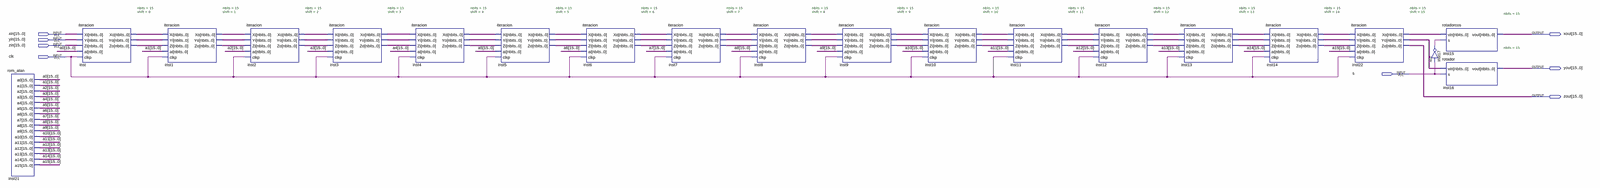
[diagram p0: schematic sheet, whole]
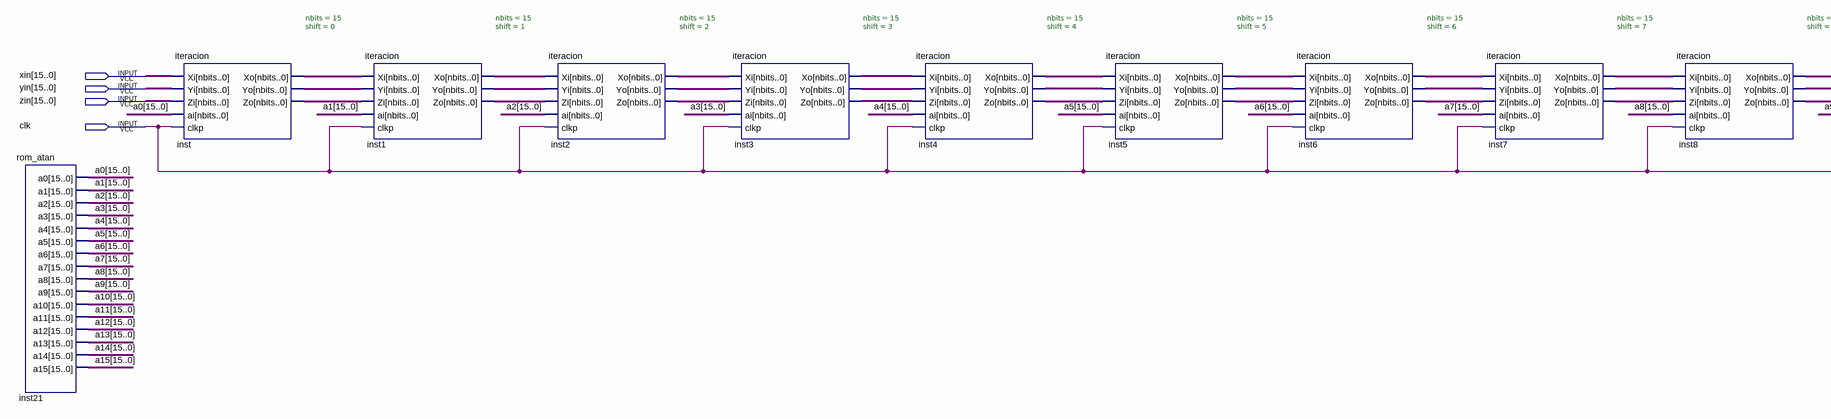
[diagram p1: schematic sheet, left part]
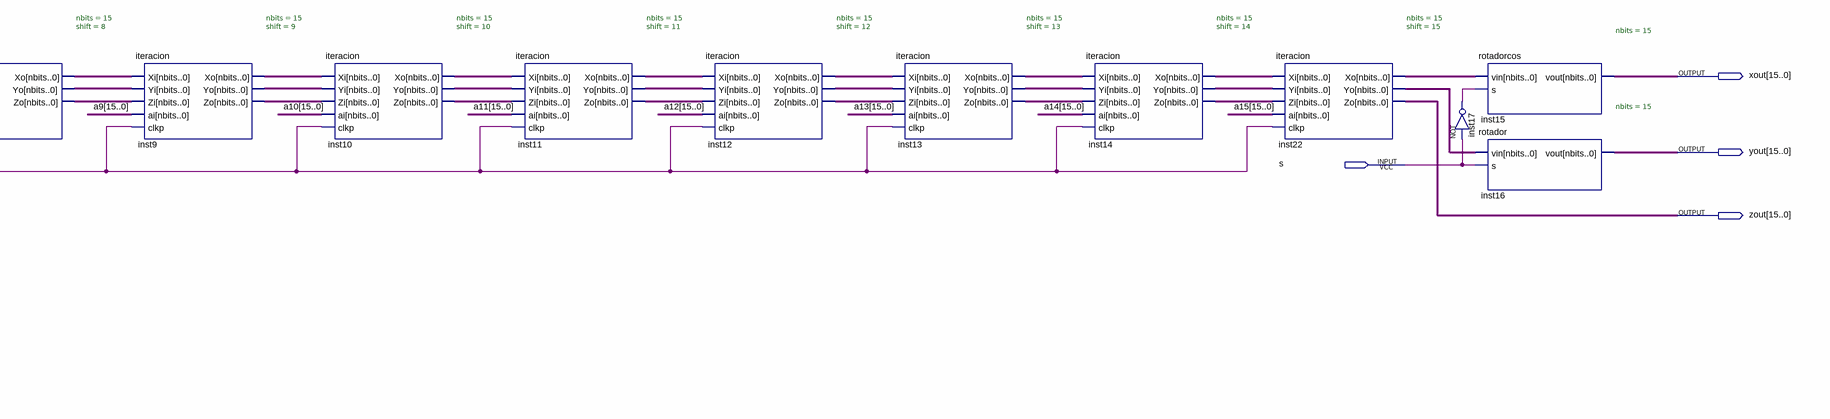
[diagram p2: schematic sheet, right part]
// Quartus schematic cordic16b.bdf as structural Verilog: 20 symbols, 8 pins
module cordic16b (
  input  [15:0] xin,
  input  [15:0] yin,
  input  [15:0] zin,
  input  clk,
  input  s,
  output [15:0] xout,
  output [15:0] yout,
  output [15:0] zout
);

  wire inst17_out;
  wire [15:0] a0, a1, a2, a3, a4, a5, a6, a7, a8, a9, a10, a11, a12, a13, a14, a15, inst1_xo, inst1_yo,
       inst1_zo, inst2_xo, inst2_yo, inst2_zo, inst3_xo, inst3_yo, inst3_zo, inst4_xo, inst4_yo, inst4_zo,
       inst5_xo, inst5_yo, inst5_zo, inst6_xo, inst6_yo, inst6_zo, inst7_xo, inst7_yo, inst7_zo, inst8_xo,
       inst8_yo, inst8_zo, inst9_xo, inst9_yo, inst9_zo, inst10_xo, inst10_yo, inst10_zo, inst11_xo,
       inst11_yo, inst11_zo, inst12_xo, inst12_yo, inst12_zo, inst13_xo, inst13_yo, inst13_zo, inst14_xo,
       inst14_yo, inst14_zo, inst22_xo, inst22_yo, inst_xo, inst_yo, inst_zo;

  rom_atan inst21 (
    .a0(a0), .a1(a1), .a2(a2), .a3(a3), .a4(a4), .a5(a5), .a6(a6), .a7(a7), .a8(a8), .a9(a9), .a10(a10),
    .a11(a11), .a12(a12), .a13(a13), .a14(a14), .a15(a15));
  iteracion #(.nbits(15), .shift(0)) inst (
    .Xi(xin), .Yi(yin), .Zi(zin), .ai(a0), .clkp(clk), .Xo(inst_xo), .Yo(inst_yo), .Zo(inst_zo));
  iteracion #(.nbits(15), .shift(1)) inst1 (
    .Xi(inst_xo), .Yi(inst_yo), .Zi(inst_zo), .ai(a1), .clkp(clk), .Xo(inst1_xo), .Yo(inst1_yo), .Zo(inst1_zo));
  iteracion #(.nbits(15), .shift(2)) inst2 (
    .Xi(inst1_xo), .Yi(inst1_yo), .Zi(inst1_zo), .ai(a2), .clkp(clk), .Xo(inst2_xo), .Yo(inst2_yo),
    .Zo(inst2_zo));
  iteracion #(.nbits(15), .shift(3)) inst3 (
    .Xi(inst2_xo), .Yi(inst2_yo), .Zi(inst2_zo), .ai(a3), .clkp(clk), .Xo(inst3_xo), .Yo(inst3_yo),
    .Zo(inst3_zo));
  iteracion #(.nbits(15), .shift(4)) inst4 (
    .Xi(inst3_xo), .Yi(inst3_yo), .Zi(inst3_zo), .ai(a4), .clkp(clk), .Xo(inst4_xo), .Yo(inst4_yo),
    .Zo(inst4_zo));
  iteracion #(.nbits(15), .shift(5)) inst5 (
    .Xi(inst4_xo), .Yi(inst4_yo), .Zi(inst4_zo), .ai(a5), .clkp(clk), .Xo(inst5_xo), .Yo(inst5_yo),
    .Zo(inst5_zo));
  iteracion #(.nbits(15), .shift(6)) inst6 (
    .Xi(inst5_xo), .Yi(inst5_yo), .Zi(inst5_zo), .ai(a6), .clkp(clk), .Xo(inst6_xo), .Yo(inst6_yo),
    .Zo(inst6_zo));
  iteracion #(.nbits(15), .shift(7)) inst7 (
    .Xi(inst6_xo), .Yi(inst6_yo), .Zi(inst6_zo), .ai(a7), .clkp(clk), .Xo(inst7_xo), .Yo(inst7_yo),
    .Zo(inst7_zo));
  iteracion #(.nbits(15), .shift(8)) inst8 (
    .Xi(inst7_xo), .Yi(inst7_yo), .Zi(inst7_zo), .ai(a8), .clkp(clk), .Xo(inst8_xo), .Yo(inst8_yo),
    .Zo(inst8_zo));
  iteracion #(.nbits(15), .shift(9)) inst9 (
    .Xi(inst8_xo), .Yi(inst8_yo), .Zi(inst8_zo), .ai(a9), .clkp(clk), .Xo(inst9_xo), .Yo(inst9_yo),
    .Zo(inst9_zo));
  iteracion #(.nbits(15), .shift(10)) inst10 (
    .Xi(inst9_xo), .Yi(inst9_yo), .Zi(inst9_zo), .ai(a10), .clkp(clk), .Xo(inst10_xo), .Yo(inst10_yo),
    .Zo(inst10_zo));
  iteracion #(.nbits(15), .shift(11)) inst11 (
    .Xi(inst10_xo), .Yi(inst10_yo), .Zi(inst10_zo), .ai(a11), .clkp(clk), .Xo(inst11_xo), .Yo(inst11_yo),
    .Zo(inst11_zo));
  iteracion #(.nbits(15), .shift(12)) inst12 (
    .Xi(inst11_xo), .Yi(inst11_yo), .Zi(inst11_zo), .ai(a12), .clkp(clk), .Xo(inst12_xo), .Yo(inst12_yo),
    .Zo(inst12_zo));
  iteracion #(.nbits(15), .shift(13)) inst13 (
    .Xi(inst12_xo), .Yi(inst12_yo), .Zi(inst12_zo), .ai(a13), .clkp(clk), .Xo(inst13_xo), .Yo(inst13_yo),
    .Zo(inst13_zo));
  iteracion #(.nbits(15), .shift(14)) inst14 (
    .Xi(inst13_xo), .Yi(inst13_yo), .Zi(inst13_zo), .ai(a14), .clkp(clk), .Xo(inst14_xo), .Yo(inst14_yo),
    .Zo(inst14_zo));
  iteracion #(.nbits(15), .shift(15)) inst22 (
    .Xi(inst14_xo), .Yi(inst14_yo), .Zi(inst14_zo), .ai(a15), .clkp(clk), .Xo(inst22_xo), .Yo(inst22_yo),
    .Zo(zout));
  not inst17 (inst17_out, s);
  rotadorcos #(.nbits(15)) inst15 (.vin(inst22_xo), .s(inst17_out), .vout(xout));
  rotador #(.nbits(15)) inst16 (.vin(inst22_yo), .s(s), .vout(yout));
endmodule
